# EAGLE design pc_pulse Express (EAGLE 9.5.2)
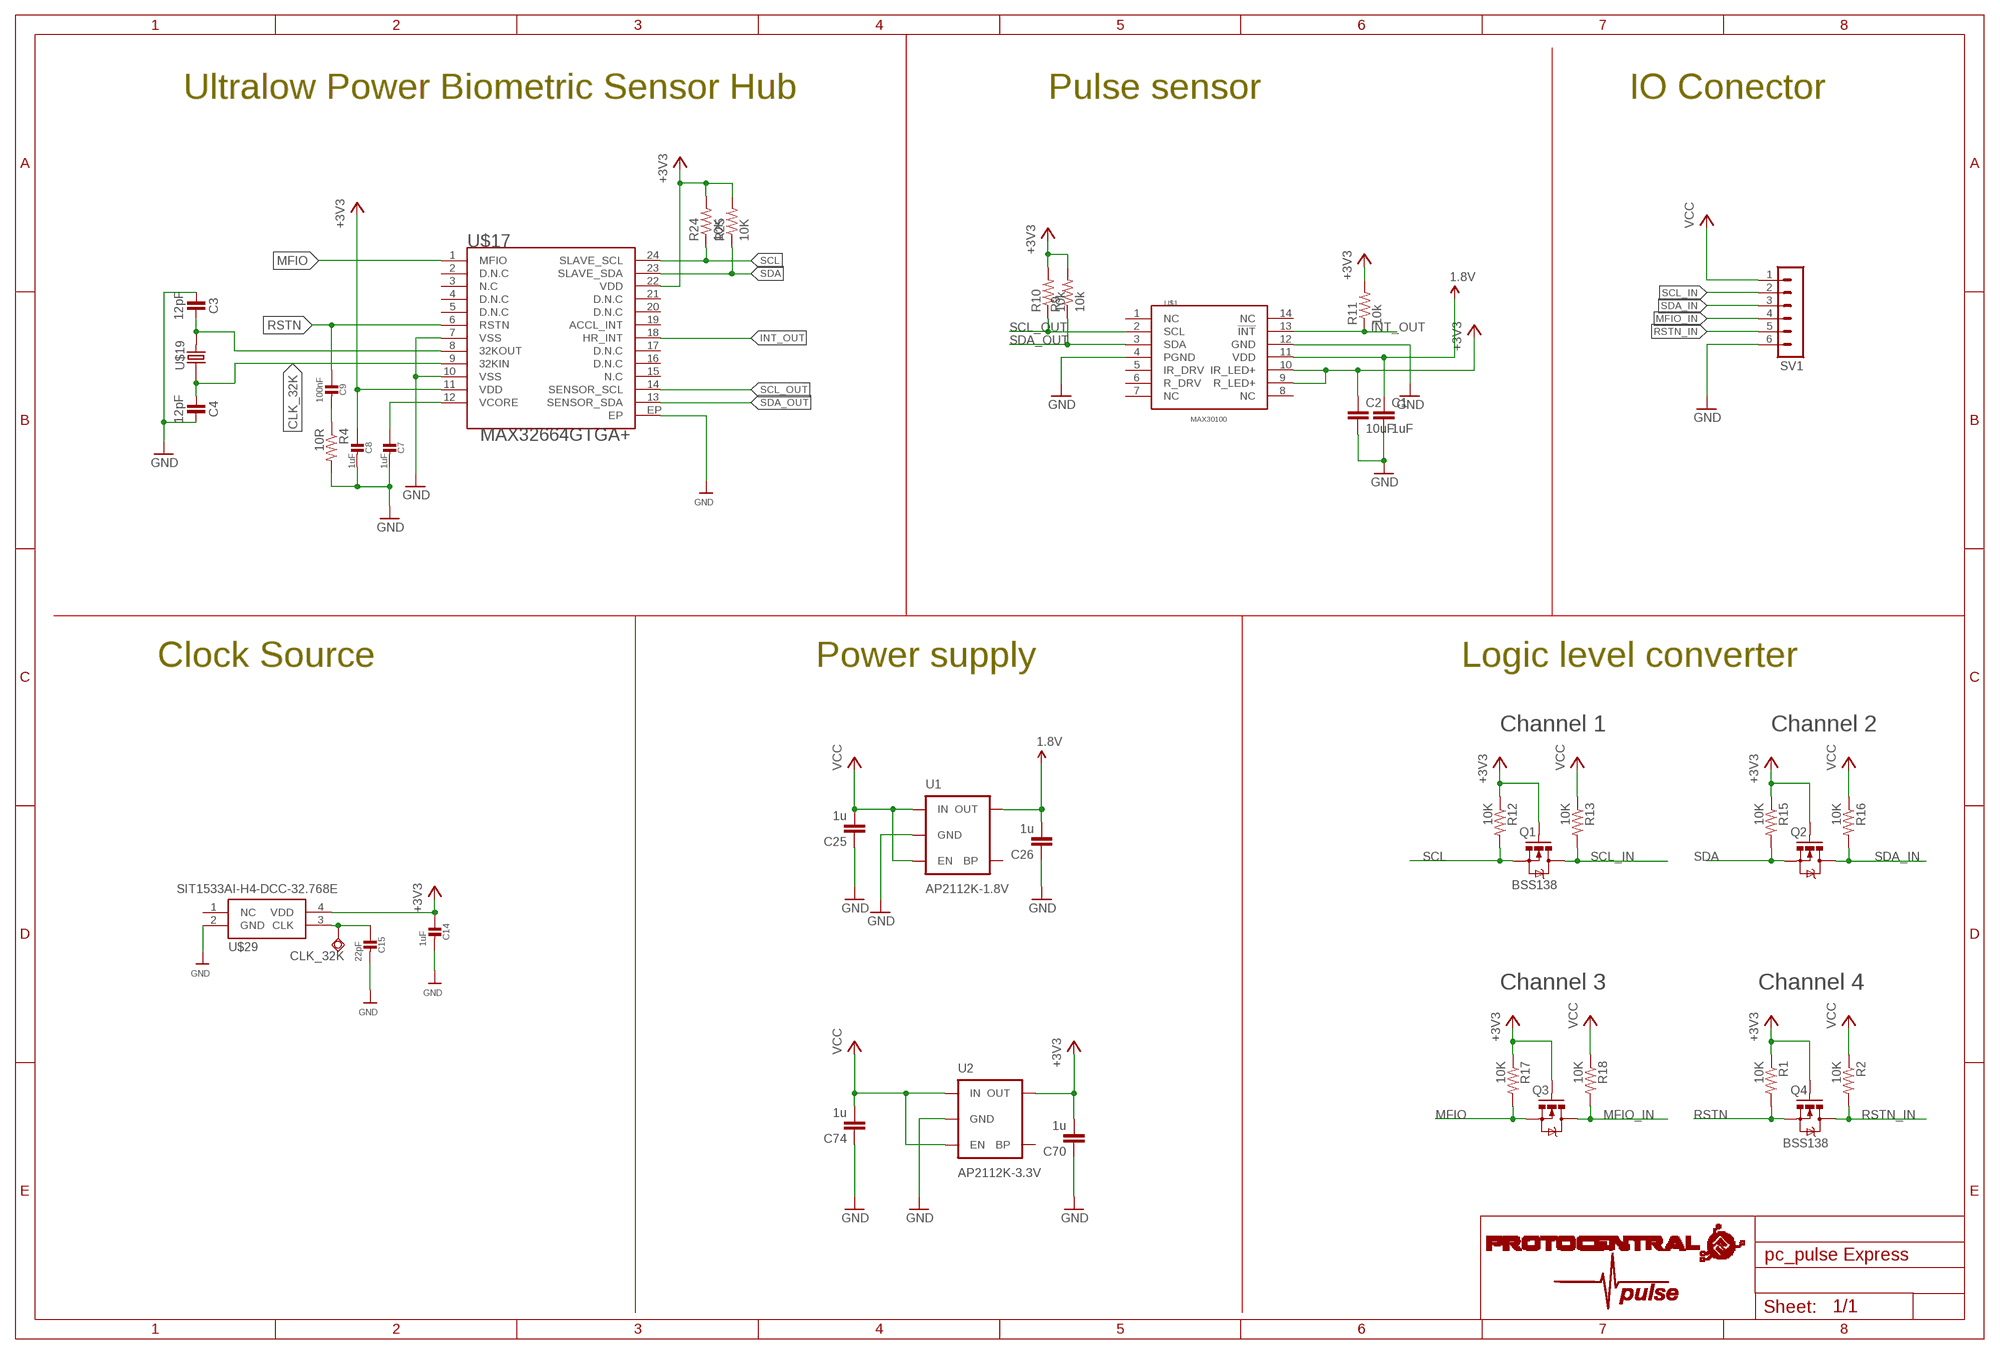
[diagram p0: schematic, sheet 1]

## Parts
C1  1uF  C-EUC0402  [C0402]
C2  10uF  C-EUC0402  [C0402]
C3  12pF  CAPACITORS-0402  [C0402]
C4  12pF  CAPACITORS-0402  [C0402]
C7  1uF  CAP_CERAMIC_0402  [_0402]
C8  1uF  CAP_CERAMIC_0402  [_0402]
C9  100nF  CAP_CERAMIC_0402  [_0402]
C14  1uF  CAP_CERAMIC_0402  [_0402]
C15  22pF  CAP_CERAMIC_0402  [_0402]
C25  1u  C-EUC0402  [C0402]
C26  1u  C-EUC0402  [C0402]
C70  1u  C-EUC0402  [C0402]
C74  1u  C-EUC0402  [C0402]
Q1  BSS138  MOSFET-NCHANNELSMD  [SOT23-3]
Q2  BSS138  MOSFET-NCHANNELSMD  [SOT23-3]
Q3  BSS138  MOSFET-NCHANNELSMD  [SOT23-3]
Q4  BSS138  MOSFET-NCHANNELSMD  [SOT23-3]
R1  10K  RESISTOR0402-RES  [0402-RES]
R2  10K  RESISTOR0402-RES  [0402-RES]
R4  10R  RESISTOR0402-RES  [0402-RES]
R9  10k  R-US_R0402  [R0402]
R10  10k  R-US_R0402  [R0402]
R11  10k  R-US_R0402  [R0402]
R12  10K  RESISTOR0402-RES  [0402-RES]
R13  10K  RESISTOR0402-RES  [0402-RES]
R15  10K  RESISTOR0402-RES  [0402-RES]
R16  10K  RESISTOR0402-RES  [0402-RES]
R17  10K  RESISTOR0402-RES  [0402-RES]
R18  10K  RESISTOR0402-RES  [0402-RES]
R24  10K  RESISTOR0402-RES  [0402-RES]
R25  10K  RESISTOR0402-RES  [0402-RES]
SV1  MA06-1  [MA06-1]
SWIO1  TPSQTP11R  [TP11R]
U1  AP2112K-1.8V  V_REG_LDOSMD  [SOT23-5]
U2  AP2112K-3.3V  V_REG_LDOSMD  [SOT23-5]
U$1  MAX30100  [OESIP-14]
U$3  PROTY_LOGO_WITH_TEXT  [PROTY_WITH_TEXT]
U$4  PULSE  [PULSESMALL]
U$17  MAX32664GTGA+  [TQFN-24L]
U$19  520-327-12.5-34B(32.768KHZ)  ECS-X-34B  [ECX-31B]
U$29  SIT1533AI-H4-DCC-32.768E  [SIT1533]

## Nets
1.8V: C1.1 C26.2 U1.5(OUT) U$1.11(VDD)
+3V3: C2.1 C8.1 C14.1 C70.2 Q1.1(G) Q2.1(G) Q3.1(G) Q4.1(G) R1.1 R9.2 R10.2 R11.2 R12.1 R15.1 R17.1 R24.2 R25.2 U2.5(OUT) U$1.9(R_LED+) U$1.10(IR_LED+) U$17.11(VDD) U$17.22(VDD) U$29.4(VDD)
CLK_32K: C4.1 C15.1 SWIO1.TP U$17.9(32KIN) U$19.P$1 U$29.3(CLK)
GND: C1.2 C2.2 C3.1 C4.2 C7.2 C8.2 C14.2 C15.2 C25.1 C26.1 C70.1 C74.1 R4.2 SV1.6 U1.2(GND) U2.2(GND) U$1.4(PGND) U$1.12(GND) U$17.7(VSS) U$17.10(VSS) U$17.EP U$29.2(GND)
INT_OUT: R11.1 U$1.13(!INT) U$17.18(HR_INT)
MFIO: Q3.2(S) R17.2 U$17.1(MFIO)
MFIO_IN: Q3.3(D) R18.2 SV1.4
N$1: C7.1 U$17.12(VCORE)
N$2: C9.2 R4.1
N$25: C3.2 U$17.8(32KOUT) U$19.P$2
RSTN: C9.1 Q4.2(S) R1.2 U$17.6(RSTN)
RSTN_IN: Q4.3(D) R2.2 SV1.5
SCL: Q1.2(S) R12.2 R24.1 U$17.24(SLAVE_SCL)
SCL_IN: Q1.3(D) R13.2 SV1.2
SCL_OUT: R10.1 U$1.2(SCL) U$17.14(SENSOR_SCL)
SDA: Q2.2(S) R15.2 R25.1 U$17.23(SLAVE_SDA)
SDA_IN: Q2.3(D) R16.2 SV1.3
SDA_OUT: R9.1 U$1.3(SDA) U$17.13(SENSOR_SDA)
VCC: C25.2 C74.2 R2.1 R13.1 R16.1 R18.1 SV1.1 U1.1(IN) U1.3(EN) U2.1(IN) U2.3(EN)
Unconnected: U1.4(BP) U2.4(BP) U$1.1(NC) U$1.5(IR_DRV) U$1.6(R_DRV) U$1.7(NC) U$1.8(NC) U$1.14(NC) U$17.2(D.N.C) U$17.3(N.C) U$17.4(D.N.C) U$17.5(D.N.C) U$17.15(N.C) U$17.16(D.N.C) U$17.17(D.N.C) U$17.19(ACCL_INT) U$17.20(D.N.C) U$17.21(D.N.C) U$29.1(NC)

## Notes on the sheet
- Ultralow Power Biometric Sensor Hub | Pulse sensor | IO Conector
- Clock Source | Power supply | Logic level converter
- Channel 1 | Channel 2
- Channel 3 | Channel 4

## Library data of the parts
C1 C2 C25 C26 = rcl:C-EU: CAPACITOR, European symbol; SPICEPREFIX: C
C3 C4 = Arduino:CAPACITORS: Capacitors ...4.7uF @ 6.3V -> 0402 ...10uF @ 16V -> 0603 ...22uF @ 25V -> 0805
C7-C9 C14 C15 = microbuilder:CAP_CERAMIC: Ceramic Capacitors For new designs, use the packages preceded by an '_' character since they are more reliable: The following footprints should be used on most boards: _0402 - Standard footprint for regular board layouts _0603 - Standard footprint for regular board layouts _0805 - Standard footprint for regular board layouts _1206 - Standard footprint for regular board layouts For extremely tight-pitch boards where space is at a premium, the following 'micro-pitch' footprints can be used (smaller pads, no silkscreen outline, etc.): _0402MP - Micro-pitch footprint for very dense/compact boards _0603MP - Micro-pitch footprint for very dense/compact boards _0805MP - Micro-pitch footprint for very dense/compact boards _1206MP - Micro-pitch footprint for very dense/compact boards
C70 C74 = rcl:C-EU: CAPACITOR, European symbol
Q1-Q4 = SparkFun:MOSFET-NCHANNEL
R1 R2 R4 R12 R13 R15-R18 R24 R25 = SparkFun:RESISTOR: Resistor Basic schematic elements and footprints for 0603, 1206, and PTH resistors.
R9-R11 = rcl:R-US_: RESISTOR, American symbol; SPICEPREFIX: R
SV1 = con-lstb:MA06-1: PIN HEADER; OC_FARNELL: unknown; OC_NEWARK: unknown
SWIO1 = testpad:TPSQ: Test pad
U1 U2 = SparkFun-PowerIC:V_REG_LDO: Voltage Regulator LDO Standard 150mA LDO voltage regulator in SOT-23 layout. Micrel part MIC5205. BP (by-pass) pin is used to lower output noise with 470pF cap.; PROD_ID: VREG-12457
U$1 = circuitects:MAX30100
U$3 = circuitects:PROTY_LOGO_WITH_TEXT
U$4 = circuitects:PULSE
U$17 = circuitects:MAX32664GTGA+
U$19 = circuitects:ECS-X-34B
U$29 = circuitects:SIT1533AI-H4-DCC-32.768E

## Net classes
2 gnd: width 0.102 mm, drill 0.1 mm

## Board
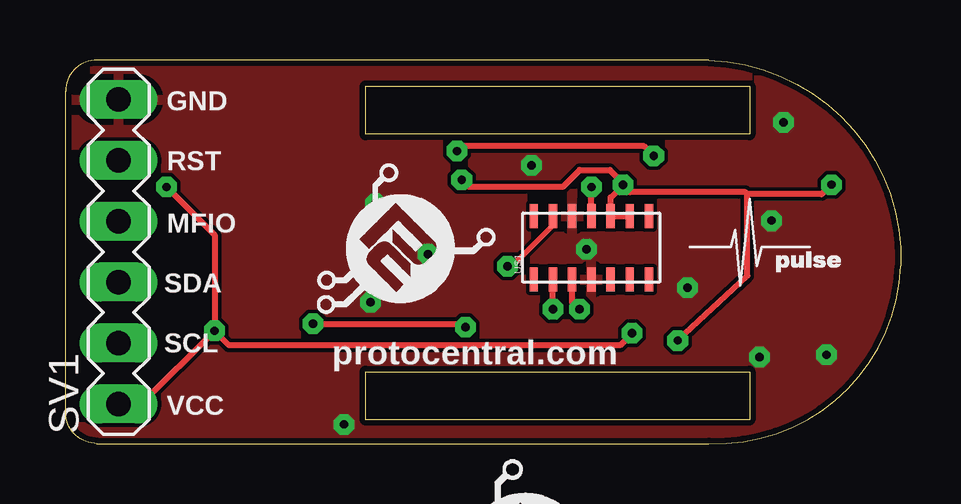
[diagram p1: board, top side]
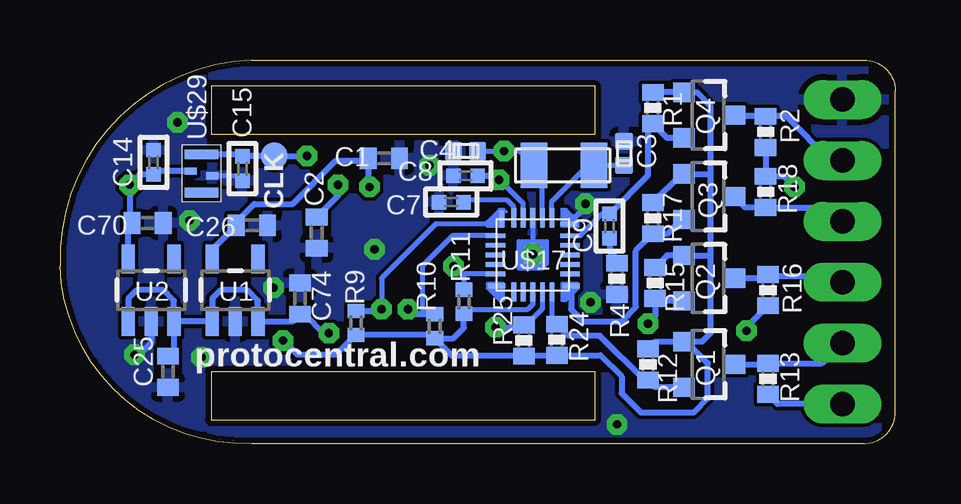
[diagram p2: board, bottom side, seen from below]

Size 34.8 x 16 mm. Coordinates in mm from the lower left corner, seen from the top.
Outline: 1.3,0 26.8,0 arc90 34.8,7.4 arc90 26.8,16 1.3,16 arc90 0,14.7 0,1.3 arc90 1.3,0
Outline: 12.5,14.9 28.5,14.9 28.5,12.9 12.5,12.9 12.5,14.9
Outline: 12.5,3 28.5,3 28.5,1 12.5,1 12.5,3
Copper layers (1*2*15*16): Top 0.035mm / dielectric 1.5mm / Route2 0.035mm / dielectric 0.15mm / Route15 0.035mm / dielectric 0.2mm / Bottom 0.035mm
Design rules "Circuitects-Rules": minimum track width 6mil, minimum drill 0.3mm, track to track 6mil, track to pad 6mil, pad to pad 6mil, via to via 6mil, smd to smd 6mil, copper to edge 10mil, drill to drill 8mil, minimum pad ring 12mil, minimum via ring 10mil, stop-mask expansion 4mil, vias tented up to drill 25mil, thermal gap 10mil

### Footprints (pad centres in the part's own frame; a part is rotated, then mirrored left to right if it is on the bottom)
C0402 = smd 0.7 x 0.9: 1 -0.65,0; 2 0.65,0
C0402' = smd 0.75 x 0.7: 1 0,0.5; 2 0,-0.5
_0402 = smd 0.6 x 0.6: 1 -0.508,0; 2 0.508,0
SOT23-3 = smd 0.8 x 0.9: 1 -0.95,-1; 2 0.95,-1; 3 0,1.1
0402-RES = smd 0.7 x 0.9: 1 -0.65,0; 2 0.65,0
R0402 = smd 0.6 x 0.7: 1 -0.5,0; 2 0.5,0
MA06-1 = drill 1.016 long: 1 -6.35,0; 2 -3.81,0; 3 -1.27,0; 4 1.27,0; 5 3.81,0; 6 6.35,0
TP11R = smd 1.1 x 1.1: TP 0,0
SOT23-5 = smd 0.55 x 1.2: 1 -0.95,-1.3; 2 0,-1.3; 3 0.95,-1.3; 4 0.95,1.3; 5 -0.95,1.3
OESIP-14 = smd 1 x 0.35: 1 -1.325,2.4; 2 -1.325,1.6; 3 -1.325,0.8; 4 -1.325,0; 5 -1.325,-0.8; 6 -1.325,-1.6; 7 -1.325,-2.4; 8 1.325,-2.4; 9 1.325,-1.6; 10 1.325,-0.8; 11 1.325,0; 12 1.325,0.8; 13 1.325,1.6; 14 1.325,2.4
TQFN-24L = smd 0.7 x 0.2: 1 -1.6,1.3; 7 -1.5,-1.3; 19 1.5,1.3 | smd 0.8 x 0.2: 2 -1.55,0.8; 3 -1.55,0.4; 4 -1.55,0; 5 -1.55,-0.4; 6 -1.55,-0.8; 14 1.55,-0.8; 15 1.55,-0.4; 16 1.55,0; 17 1.55,0.4; 18 1.55,0.8 | smd 0.2 x 0.8: 8 -0.8,-1.55; 9 -0.4,-1.55; 10 0,-1.55; 11 0.4,-1.55; 12 0.8,-1.55; 20 0.8,1.55; 21 0.4,1.55; 22 0,1.55; 23 -0.4,1.55; 24 -0.8,1.55 | smd 0.2 x 0.7: 13 1.3,-1.5 | smd 0.7 x 0.7: EP 0,0
ECX-31B = smd 1.1 x 1.9: P$1 1.25,0; P$2 -1.25,0
SIT1533 = smd 0.4 x 1.4: 1 -0.8,0; 3 0.8,0 | smd 0.3 x 0.5: 2 -0.1,-0.45; 4 0.1,0.45

### Placement (x,y rotation side)
C1  21.3,11.9 0 bottom
C2  24.1,8.8 270 bottom
C3  12pF  [C0402']  11.3,12.1 0 bottom
C4  12pF  [C0402']  17.9,12.2 270 bottom
C7  18.5,10.07 180 bottom
C8  17.9,11.17 180 bottom
C9  11.9,9.07 270 bottom
C14  30.9,11.73 90 bottom
C15  27.2,11.47 270 bottom
C25  30.3,3 90 bottom
C26  26.8,9.1 180 bottom
C70  31.15,9.2 180 bottom
C74  24.8,6.05 270 bottom
Q1  7.8,3.3 270 bottom
Q2  7.8,6.9 270 bottom
Q3  7.8,10.3 270 bottom
Q4  7.8,13.7 270 bottom
R1  10.1,14 270 bottom
R2  5.4,13 90 bottom
R4  11.6,6.87 270 bottom
R9  22.47,5.03 270 bottom
R10  19.19,4.89 270 bottom
R11  17.97,5.91 270 bottom
R12  10.3,3.3 270 bottom
R13  5.3,2.7 90 bottom
R15  10,6.7 270 bottom
R16  5.3,6.4 90 bottom
R17  10.1,9.4 270 bottom
R18  5.4,10.5 270 bottom
R24  14.1,4.33 270 bottom
R25  15.47,4.3 270 bottom
SV1  2.2,8 90 top
SWIO1  25.87,12 180 bottom
U1  27.5,6.4 0 bottom
U2  31,6.4 0 bottom
U$1  21.9,8.17 90 top
U$3  -1.2,-7.2 0 top  (outside the outline)
U$4  26,8.2 0 top
U$5  PROTY-LOGO  [LOGO-PROTY@1]  10.4,5.3 0 top
U$17  15.1,7.87 180 bottom
U$19  13.8,11.6 180 bottom
U$29  28.9,11.27 90 bottom

### Tracks (layer width: path | path; a pad name or v marks a point on that pad's centre or on a via)
1.8V  (via drill 0.35)
  Top 0.254: U$1.11 v21.9,10.7
  Bottom 0.254: U1.5 28.45,8.1 C26.2 27.45,9.25 26.7,10 25.1,10 23.3,11.8 21.95,11.8 | C1.1 21.95,11.8 | 21.95,11.8 21.95,10.75 v21.9,10.7
+3V3  (via drill 0.35)
  Top 0.254: U$1.9 U$1.10 22.7,10.27 v23.21,10.79 | v31.9,10.8 31.5,10.4 28.4,10.4 | 28.4,10.4 28.32,10.48 23.52,10.48 v23.21,10.79 | 28.4,10.4 28.4,7 v25.5,4.3 | v16.5,11 16.8,10.7 20.7,10.7 21.41,11.41 22.68,11.41 23.21,10.87 v23.21,10.79
  Bottom 0.2: U$17.22 15.1,5.8 15.3,5.6 17.78,5.6 R11.2 | U$17.11 15.5,10.02 16.48,11 v16.5,11
  Bottom 0.254: R12.1 10,4.25 Q1.1 8.7,4.25 | R15.1 9.5,7.85 Q2.1 7.75,7.85 7.7,7.9 | R17.1 8.9,11.25 Q3.1 7.75,11.25 7.7,11.3 | R1.1 Q4.1 8.25,14.65 7.7,14.1 7.7,11.3 | 7.7,11.3 7.7,7.9 | 7.7,7.9 7.7,4.6 8.05,4.25 8.7,4.25 | R10.2 19.33,4.53 R9.2 23.3,3.7 24.9,3.7 v25.5,4.3 | U2.5 31.95,9.05 C70.2 31.9,9.3 v31.9,10.8 31.48,11.22 C14.1 30.75,11.37 U$29.4 | R10.2 18.41,4.39 17.97,4.83 R11.2 | R10.2 18.45,3.65 R25.2 15.44,3.68 R24.2 12.28,3.68 11.4,2.8 11.4,2.1 10.6,1.3 8.4,1.3 7.8,1.9 7.8,3.35 8.7,4.25 | 23.86,9.21 C2.1 23.21,10.34 v23.21,10.79 | C8.1 16.67,11.17 v16.5,11
CLK_32K  (via drill 0.35)
  Top 0.254: v24.5,12 24.1,12.4 16.5,12.4 v16.3,12.2
  Bottom 0.2: U$17.9 14.7,11.25 U$19.P$1 15.65,12.2 v16.3,12.2 C4.1
  Bottom 0.254: 25.94,12.07 SWIO1.TP | SWIO1.TP v24.5,12 | SWIO1.TP 27.18,12 | 27.18,12 C15.1 | U$29.3 27.25,12.07 27.18,12
GND  (via drill 0.35)
  Bottom 0.2: U$17.10 v15.1,7.9 U$17.EP | U$29.2 27.41,11.17 C15.2
  Bottom 0.254: U2.2 31,4.2 31.4,3.8 | U$17.7 12.9,9.87 v12.9,10
  other vias: 29.4,9.3 29.9,13.4 31.7,3.7 11.6,0.8 12.7,5.9 21.7,8.1 25.9,6.5 19.4,11.6 28.9,3.6
  pour Top: -0.54,16.21 34.96,16.3 35.31,-0.2 -0.2,-0.3
  pour Bottom: -0.55,16.23 34.95,16.4 35.3,-0.19 -0.19,-0.34
INT_OUT  (via drill 0.35)
  Top 0.2: U$1.13 20.3,9.1 18.6,7.4 v18.4,7.4
  Bottom 0.2: R11.1 17.97,6.97 v18.4,7.4 18.07,7.07 U$17.18
MFIO
  Bottom 0.254: Q3.2 9.1,9.05 9.2,9.05 9.5,8.75 R17.2 10.8,8.05 10.8,5.7 11.4,5.1 13,5.1 13.5,5.6 U$17.1
MFIO_IN
  Bottom 0.254: Q3.3 6.25,9.85 R18.2 2.78,9.85 SV1.4
N$1
  Bottom 0.2: C7.1 17.89,10.17 16.19,10.17 15.9,9.88 U$17.12
N$2
  Bottom 0.254: R4.1 11.5,7.62 11.9,8.02 C9.2
N$25
  Bottom 0.2: U$17.8 14.3,10.1 12.8,11.6 U$19.P$2 C3.2
RSTN
  Bottom 0.2: U$17.6 13.13,8.67 12.22,9.58 C9.1
  Bottom 0.254: Q4.2 9.5,12.75 R1.2 10.3,13.35 10.3,11.18 C9.1
RSTN_IN
  Bottom 0.254: SV1.5 2.71,11.81 4.55,13.65 R2.2 6.65,13.65 Q4.3
SCL
  Bottom 0.2: U$17.24 14.3,5.18 R24.1
  Bottom 0.254: Q1.2 10,2.35 R12.2 10.45,2.65 12.3,4.5 13.62,4.5 R24.1
SCL_IN
  Bottom 0.254: Q1.3 5.35,3.3 R13.2 3.04,3.35 SV1.2
SCL_OUT  (via drill 0.35)
  Top 0.254: v20.3,5.6 U$1.2
  Bottom 0.2: U$17.14 18.43,8.67 19.7,7.4 19.7,5.59 19.5,5.39
  Bottom 0.254: R10.1 19.5,5.39 20.09,5.39 v20.3,5.6
SDA  (via drill 0.35)
  Top 0.254: v16.65,4.85 16.5,5 v10.3,5
  Bottom 0.2: U$17.23 14.7,5.62 15.37,4.95 R25.1
  Bottom 0.254: Q2.2 9.9,5.95 R15.2 10,5.3 v10.3,5 | v16.65,4.85 15.57,4.85 R25.1
SDA_IN
  Bottom 0.254: Q2.3 5.45,6.9 5.38,6.97 | 5.38,6.97 R16.2 | SV1.3 2.44,6.97 5.38,6.97
SDA_OUT  (via drill 0.35)
  Top 0.254: v21.4,5.6 21.1,5.9 U$1.3
  Bottom 0.2: U$17.13 16.6,9.17 19.13,9.17 21.4,6.9 v21.4,5.6
  Bottom 0.254: R9.1 21.47,5.53 v21.4,5.6
VCC  (via drill 0.35)
  Top 0.254: v4.2,10.7 6.2,8.7 v6.2,4.7 | v23.6,4.6 23.1,4.1 6.8,4.1 v6.2,4.7 | SV1.1 3.15,1.65 v6.2,4.7
  Bottom 0.254: R2.1 R18.1 4.65,11.15 v4.2,10.7 | SV1.1 4.9,1.65 R13.1 | R16.1 6.2,4.85 v6.2,4.7 | U2.3 U1.1 28.45,6.05 28.1,6.4 27,6.4 26.55,5.95 U1.3 25.1,5.1 C74.2 24.6,5.4 23.8,4.6 v23.6,4.6 | U2.3 30.05,5.95 30.5,6.4 31.6,6.4 31.95,6.05 U2.1 | U2.3 30.05,3.9 C25.2

### Text on the board
tPlace: GND | RST | MFIO | SDA | SCL | protocentral.com | VCC
bPlace: CLK | protocentral.com